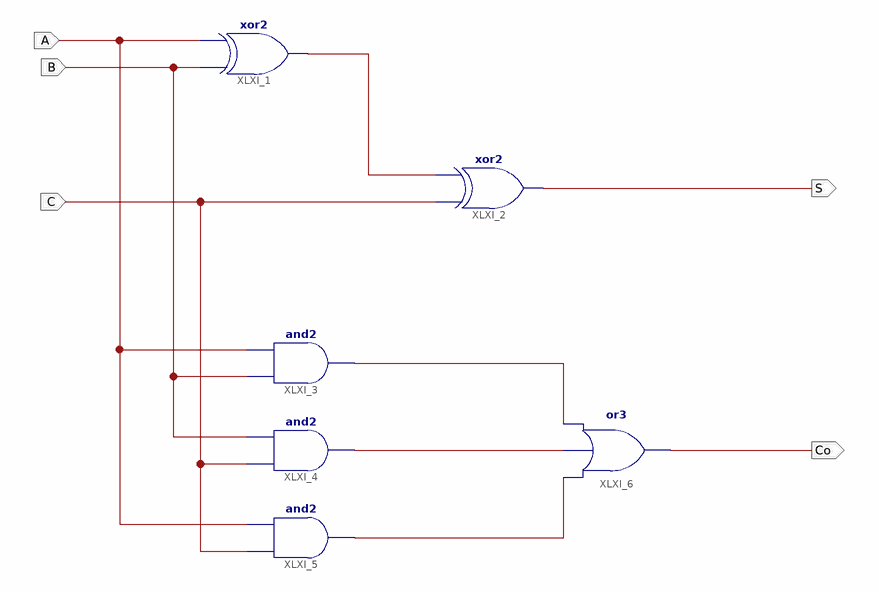
[diagram p0: schematic sheet 1]
// Xilinx ISE schematic Adder_1b.sch (kintex7) as structural Verilog: 6 symbols, 5 ports
module Adder_1b (
  input  A,
  input  C,
  input  B,
  output Co,
  output S
);

  wire XLXN_7, XLXN_8, XLXN_9, XLXN_12;

  xor XLXI_1 (XLXN_12, B, A);
  xor XLXI_2 (S, C, XLXN_12);
  and XLXI_3 (XLXN_7, B, A);
  and XLXI_4 (XLXN_8, C, B);
  and XLXI_5 (XLXN_9, C, A);
  or XLXI_6 (Co, XLXN_9, XLXN_8, XLXN_7);
endmodule
